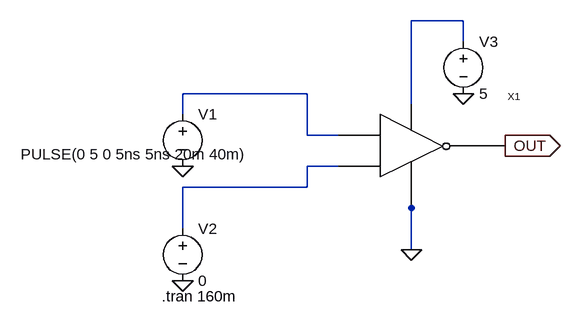
[diagram p0: schematic notgateimplytest.asc]
notgateimplytest.asc, the LTspice schematic file:
Version 4
SHEET 1 880 680
WIRE 304 -64 224 -64
WIRE 304 -32 304 -64
WIRE 64 48 -128 48
WIRE 224 64 224 -64
WIRE -128 80 -128 48
WIRE 64 112 64 48
WIRE 112 112 64 112
WIRE 112 160 64 160
WIRE 64 192 64 160
WIRE 64 192 -128 192
WIRE -128 256 -128 192
WIRE 224 288 224 208
FLAG 304 48 0
FLAG 224 288 0
FLAG -128 336 0
FLAG -128 160 0
FLAG 368 128 OUT
IOPIN 368 128 Out
SYMBOL notgateimply 192 128 R0
SYMATTR InstName X1
SYMBOL voltage -128 64 R0
WINDOW 123 0 0 Left 0
WINDOW 39 0 0 Left 0
WINDOW 3 -249 77 Left 2
SYMATTR InstName V1
SYMATTR Value PULSE(0 5 0 5ns 5ns 20m 40m)
SYMBOL voltage -128 240 R0
WINDOW 123 0 0 Left 0
WINDOW 39 0 0 Left 0
SYMATTR InstName V2
SYMATTR Value 0
SYMBOL voltage 304 -48 R0
WINDOW 123 0 0 Left 0
WINDOW 39 0 0 Left 0
SYMATTR InstName V3
SYMATTR Value 5
TEXT -160 360 Left 2 !.tran 160m

The netlist it stands for:
* notgateimplytest.asc
XX1 OUT N002 N003 N001 0 notgateimply  ; pins OUT IN1 IN2 VDD VSS
V1 N002 0 PULSE(0 5 0 5ns 5ns 20m 40m)
V2 N003 0 0
V3 N001 0 5
.tran 160m
.backanno
.end